# EAGLE design Op Amp VU Meter 3 Led (EAGLE 9.4.2)

## Sheet 1 of 2
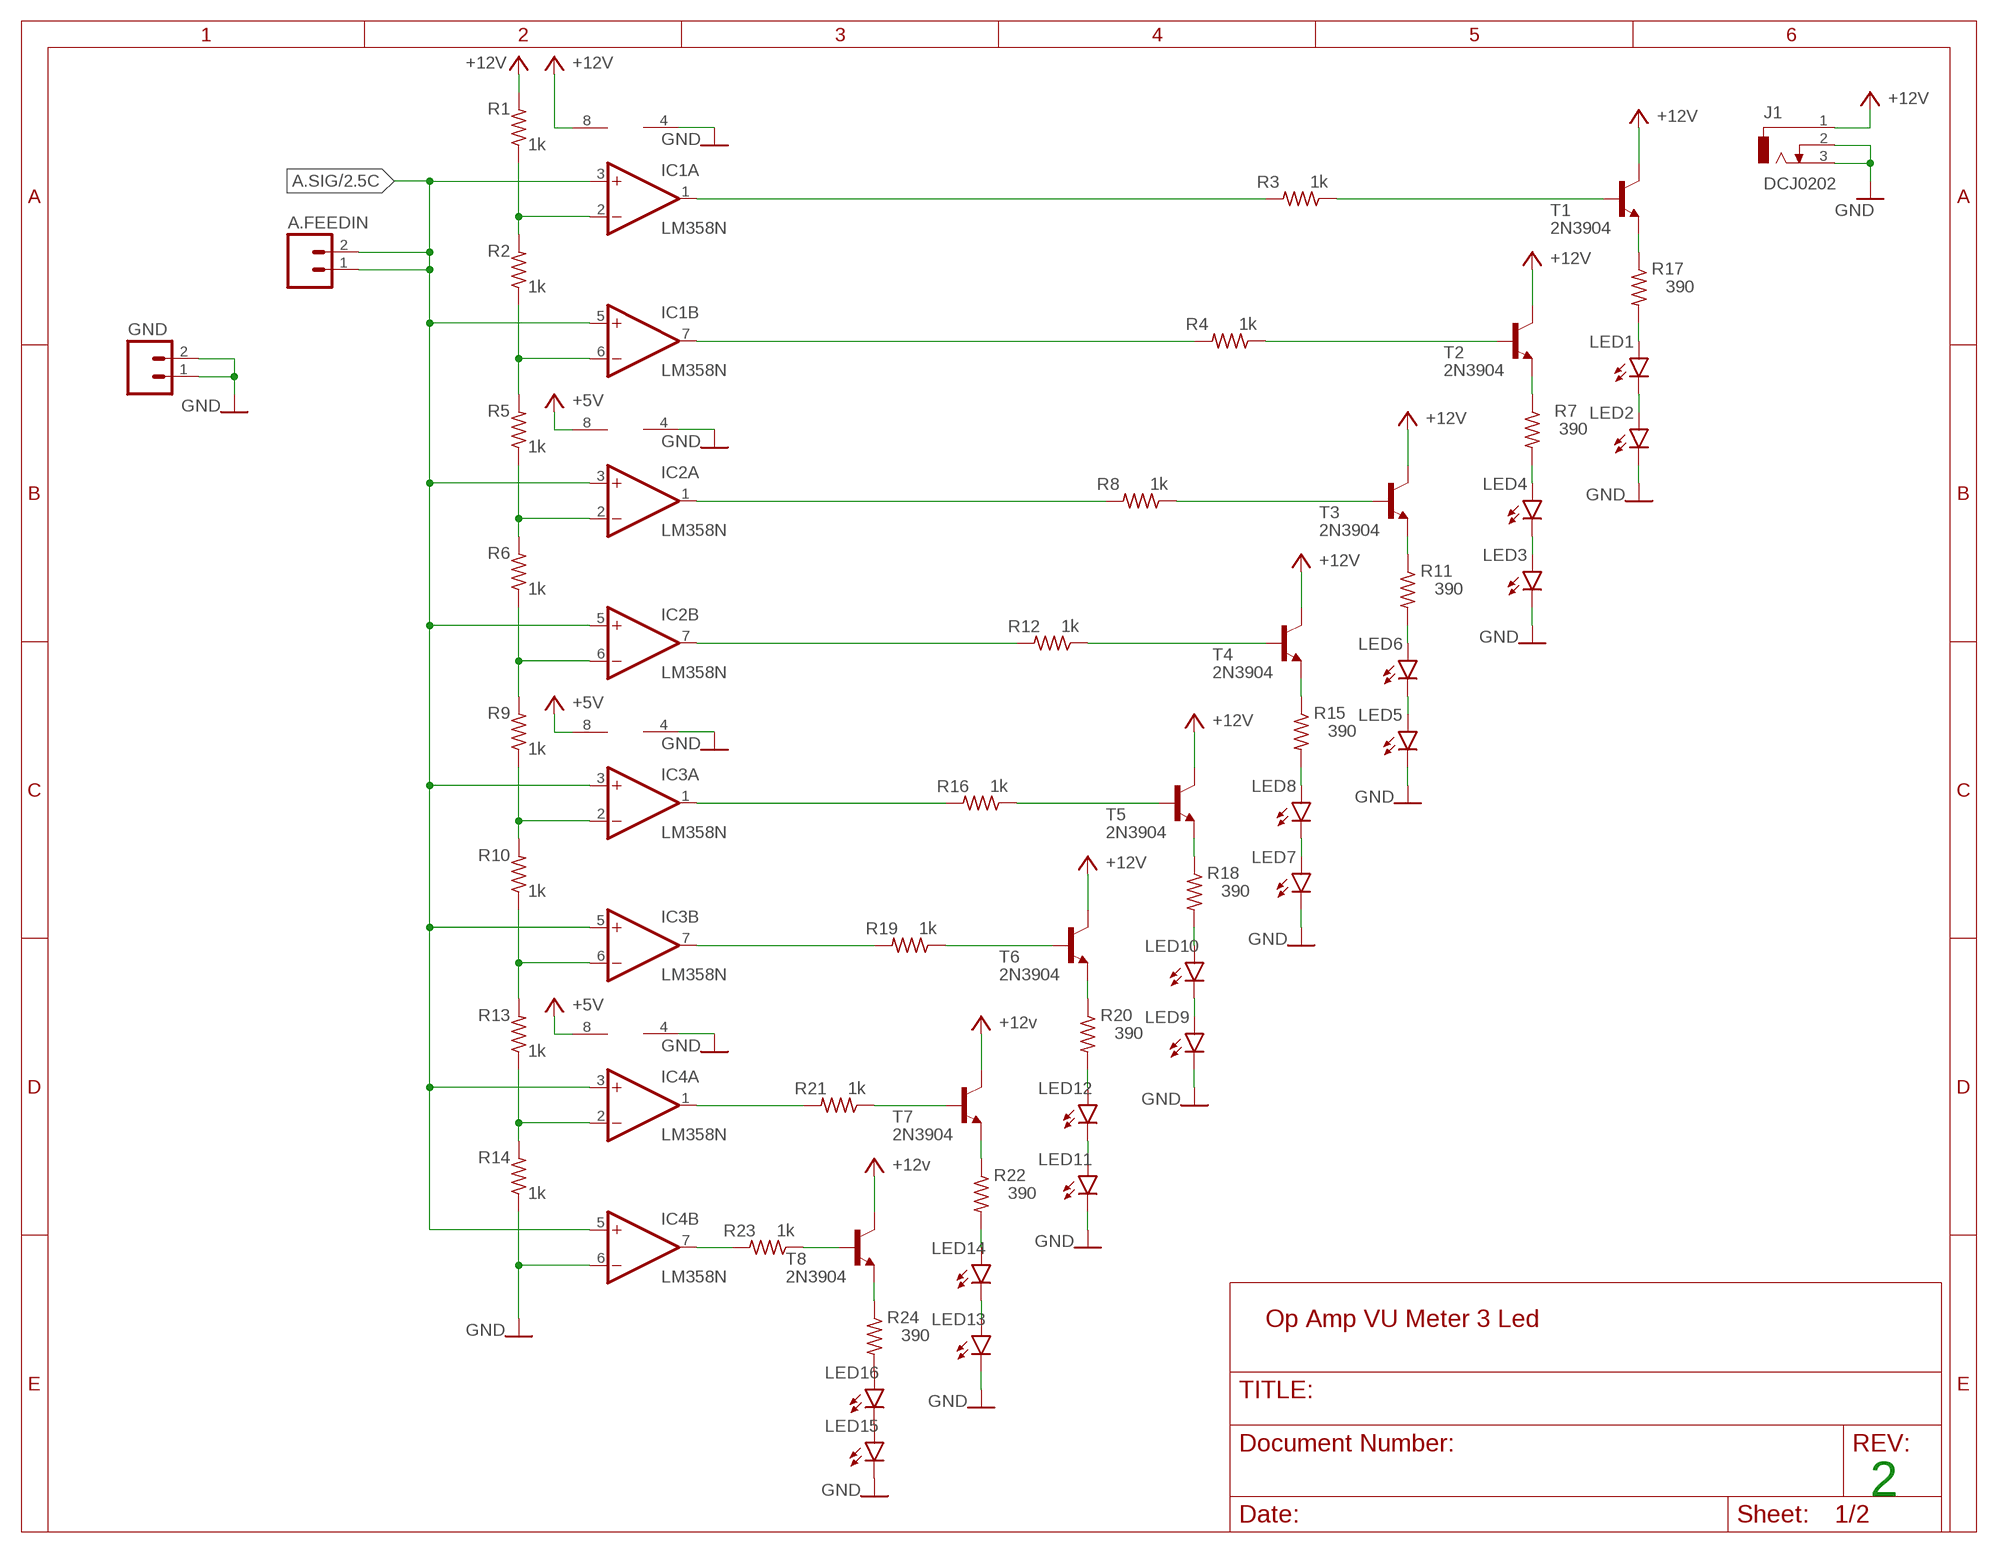
[diagram p0: schematic, sheet 1]

### Parts
A.FEEDIN  MA02  [02PA]
GND  MA02  [02PA]
IC1  LM358N  [DIL08]
IC2  LM358N  [DIL08]
IC3  LM358N  [DIL08]
IC4  LM358N  [DIL08]
J1  DCJ0202  [DCJ0202]
LED1  LED5MM  [LED5MM]
LED2  LED5MM  [LED5MM]
LED3  LED5MM  [LED5MM]
LED4  LED5MM  [LED5MM]
LED5  LED5MM  [LED5MM]
LED6  LED5MM  [LED5MM]
LED7  LED5MM  [LED5MM]
LED8  LED5MM  [LED5MM]
LED9  LED5MM  [LED5MM]
LED10  LED5MM  [LED5MM]
LED11  LED5MM  [LED5MM]
LED12  LED5MM  [LED5MM]
LED13  LED5MM  [LED5MM]
LED14  LED5MM  [LED5MM]
LED15  LED5MM  [LED5MM]
LED16  LED5MM  [LED5MM]
R1  1k  R-US_0207/12  [0207/12]
R2  1k  R-US_0207/12  [0207/12]
R3  1k  R-US_0207/12  [0207/12]
R4  1k  R-US_0207/12  [0207/12]
R5  1k  R-US_0207/12  [0207/12]
R6  1k  R-US_0207/12  [0207/12]
R7  390  R-US_0207/12  [0207/12]
R8  1k  R-US_0207/12  [0207/12]
R9  1k  R-US_0207/12  [0207/12]
R10  1k  R-US_0207/12  [0207/12]
R11  390  R-US_0207/12  [0207/12]
R12  1k  R-US_0207/12  [0207/12]
R13  1k  R-US_0207/12  [0207/12]
R14  1k  R-US_0207/12  [0207/12]
R15  390  R-US_0207/12  [0207/12]
R16  1k  R-US_0207/12  [0207/12]
R17  390  R-US_0207/12  [0207/12]
R18  390  R-US_0207/12  [0207/12]
R19  1k  R-US_0207/12  [0207/12]
R20  390  R-US_0207/12  [0207/12]
R21  1k  R-US_0207/12  [0207/12]
R22  390  R-US_0207/12  [0207/12]
R23  1k  R-US_0207/12  [0207/12]
R24  390  R-US_0207/12  [0207/12]
T1  2N3904  [TO92]
T2  2N3904  [TO92]
T3  2N3904  [TO92]
T4  2N3904  [TO92]
T5  2N3904  [TO92]
T6  2N3904  [TO92]
T7  2N3904  [TO92]
T8  2N3904  [TO92]

### Nets
+5V: IC1.8(P:V+) IC2.8(P:V+) IC3.8(P:V+) IC4.8(P:V+) J1.1 R1.2 T1.1(C) T2.1(C) T3.1(C) T4.1(C) T5.1(C) T6.1(C) T7.1(C) T8.1(C) ; supply symbol labelled +12V, +12v ; also sheet 2
A.SIG: A.FEEDIN.1 A.FEEDIN.2 IC1.3(A:+IN) IC1.5(B:+IN) IC2.3(A:+IN) IC2.5(B:+IN) IC3.3(A:+IN) IC3.5(B:+IN) IC4.3(A:+IN) IC4.5(B:+IN) ; also sheet 2
GND: GND.1 GND.2 IC1.4(P:V-) IC2.4(P:V-) IC3.4(P:V-) IC4.4(P:V-) IC4.6(B:-IN) J1.2 J1.3 LED2.K(C) LED3.K(C) LED5.K(C) LED7.K(C) LED9.K(C) LED11.K(C) LED13.K(C) LED15.K(C) R14.1 ; also sheet 2
N$1: IC1.2(A:-IN) R1.1 R2.2
N$2: IC1.6(B:-IN) R2.1 R5.2
N$3: IC1.1(A:OUT) R3.2
N$4: R3.1 T1.2(B)
N$5: IC1.7(B:OUT) R4.2
N$6: LED1.K(C) LED2.A
N$7: IC2.2(A:-IN) R5.1 R6.2
N$8: IC2.6(B:-IN) R6.1 R9.2
N$9: IC2.1(A:OUT) R8.2
N$10: LED1.A R17.2
N$11: IC2.7(B:OUT) R12.2
N$12: R8.1 T3.2(B)
N$13: IC3.6(B:-IN) R10.1 R13.2
N$14: IC3.2(A:-IN) R9.1 R10.2
N$16: IC3.1(A:OUT) R16.2
N$17: R4.1 T2.2(B)
N$18: IC3.7(B:OUT) R19.2
N$19: R7.1 T2.3(E)
N$20: IC4.2(A:-IN) R13.1 R14.2
N$22: IC4.1(A:OUT) R21.2
N$23: LED3.A LED4.K(C)
N$24: IC4.7(B:OUT) R23.2
N$25: LED4.A R7.2
N$26: R17.1 T1.3(E)
N$27: R11.1 T3.3(E)
N$28: LED5.A LED6.K(C)
N$29: LED6.A R11.2
N$30: R12.1 T4.2(B)
N$31: R15.1 T4.3(E)
N$32: LED7.A LED8.K(C)
N$33: LED8.A R15.2
N$34: R16.1 T5.2(B)
N$35: R18.1 T5.3(E)
N$36: LED9.A LED10.K(C)
N$37: LED10.A R18.2
N$38: R19.1 T6.2(B)
N$39: R20.1 T6.3(E)
N$40: LED11.A LED12.K(C)
N$41: LED12.A R20.2
N$42: R21.1 T7.2(B)
N$43: R22.1 T7.3(E)
N$44: LED13.A LED14.K(C)
N$45: LED14.A R22.2
N$46: R23.1 T8.2(B)
N$47: R24.1 T8.3(E)
N$48: LED15.A LED16.K(C)
N$49: LED16.A R24.2

### Notes on the sheet
- 2

## Sheet 2 of 2
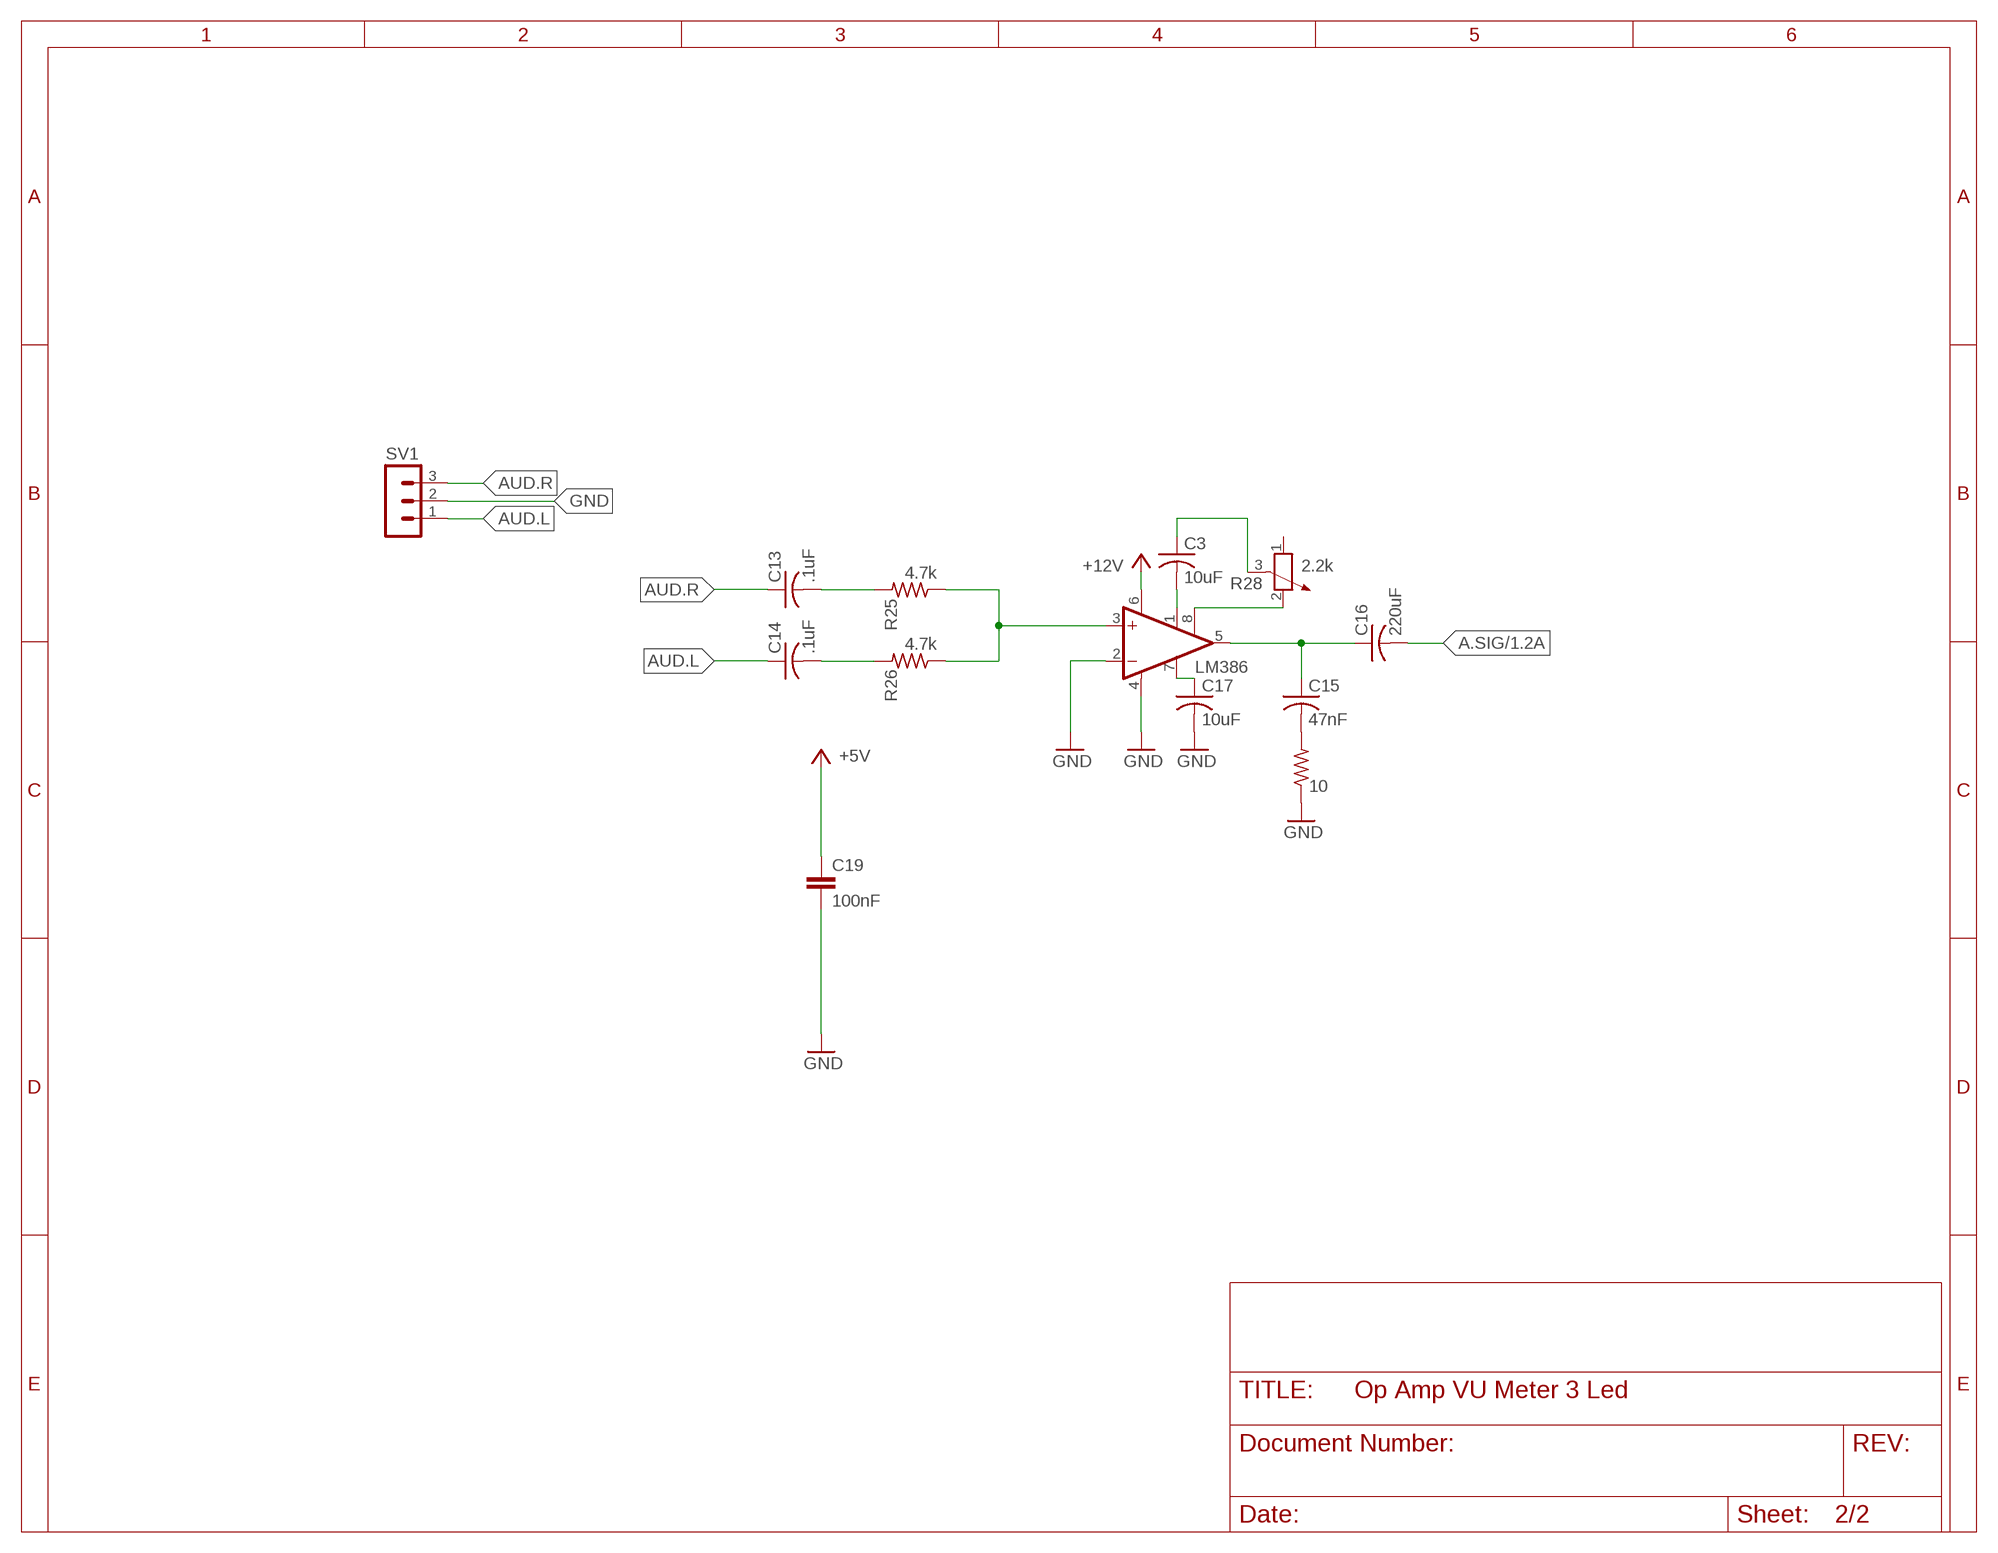
[diagram p1: schematic, sheet 2]

### Parts
C3  10uF  C-US050-024X044  [C050-024X044]
C13  .1uF  C-US050-024X044  [C050-024X044]
C14  .1uF  C-US050-024X044  [C050-024X044]
C15  47nF  C-US050-024X044  [C050-024X044]
C16  220uF  C-US050-024X044  [C050-024X044]
C17  10uF  C-US050-024X044  [C050-024X044]
C19  100nF  C-EU025-025X050  [C025-025X050]
LM386  LM386N-1  [DIL08]
R25  4.7k  R-US_0207/12  [0207/12]
R26  4.7k  R-US_0207/12  [0207/12]
R27  10  R-US_0207/12  [0207/12]
R28  2.2k  POTENTIOMETER_PT-10S  [PT-10S]
SV1  MA03-1  [MA03-1]

### Nets
+5V: C19.1 LM386.6(VS) ; supply symbol labelled +12V ; also sheet 1
A.SIG: C16.2 ; also sheet 1
AUD.L: C14.1 SV1.1
AUD.R: C13.1 SV1.3
GND: C17.2 C19.2 LM386.2(-IN) LM386.4(GND) R27.1 SV1.2 ; also sheet 1
N$15: C13.2 R25.2
N$50: C14.2 R26.2
N$51: LM386.3(+IN) R25.1 R26.1
N$52: C15.1 C16.1 LM386.5(OUT)
N$53: C17.1 LM386.7(BYPASS)
N$54: C15.2 R27.2
N$55: C3.2 LM386.1(GAIN)
N$56: LM386.8(GAIN) R28.2
N$57: C3.1 R28.3
Unconnected: R28.1

## Library data of the parts
A.FEEDIN GND = con-amp-quick:MA02: AMP QUICK CONNECTOR; OC_FARNELL: unknown; OC_NEWARK: unknown
C3 C13-C17 = rcl:C-US: CAPACITOR, American symbol; SPICEPREFIX: C
C19 = rcl:C-EU: CAPACITOR, European symbol
IC1-IC4 = linear:LM358: OP AMP also LM158; LM258; LM2904 Source: http://cache.national.com/ds/LM/LM158.pdf
J1 = con-jack:DCJ0202: DC POWER JACK Source: DCJ0202.pdf; OC_FARNELL: unknown; OC_NEWARK: unknown
LED1-LED16 = led:LED: LED OSRAM: - CHIPLED LG R971, LG N971, LY N971, LG Q971, LY Q971, LO R971, LY R971 LH N974, LH R974 LS Q976, LO Q976, LY Q976 LO Q996 - Hyper CHIPLED LW Q18S LB Q993, LB Q99A, LB R99A - SideLED LS A670, LO A670, LY A670, LG A670, LP A670 LB A673, LV A673, LT A673, LW A673 LH A674 LY A675 LS A676, LA A676, LO A676, LY A676, LW A676 LS A679, LY A679, LG A679 - Hyper Micro SIDELED® LS Y876, LA Y876, LO Y876, LY Y876 LT Y87S - SmartLED LW L88C, LW L88S LB L89C, LB L89S, LG L890 LS L89K, LO L89K, LY L89K LS L896, LA L896, LO L896, LY L896 - TOPLED LS T670, LO T670, LY T670, LG T670, LP T670 LSG T670, LSP T670, LSY T670, LOP T670, LYG T670 LG T671, LOG T671, LSG T671 LB T673, LV T673, LT T673, LW T673 LH T674 LS T676, LA T676, LO T676, LY T676, LB T676, LH T676, LSB T676, LW T676 LB T67C, LV T67C, LT T67C, LS T67K, LO T67K, LY T67K, LW E67C LS E67B, LA E67B, LO E67B, LY E67B, LB E67C, LV E67C, LT E67C LW T67C LS T679, LY T679, LG T679 LS T770, LO T770, LY T770, LG T770, LP T770 LB T773, LV T773, LT T773, LW T773 LH T774 LS E675, LA E675, LY E675, LS T675 LS T776, LA T776, LO T776, LY T776, LB T776 LHGB T686 LT T68C, LB T68C - Hyper Mini TOPLED® LB M676 - Mini TOPLED Santana® LG M470 LS M47K, LO M47K, LY M47K Source: http://www.osram.convergy.de LUXEON: - LUMILED® LXK2-PW12-R00, LXK2-PW12-S00, LXK2-PW14-U00, LXK2-PW14-V00 LXK2-PM12-R00, LXK2-PM12-S00, LXK2-PM14-U00 LXK2-PE12-Q00, LXK2-PE12-R00, LXK2-PE12-S00, LXK2-PE14-T00, LXK2-PE14-U00 LXK2-PB12-K00, LXK2-PB12-L00, LXK2-PB12-M00, LXK2-PB14-N00, LXK2-PB14-P00, LXK2-PB14-Q00 LXK2-PR12-L00, LXK2-PR12-M00, LXK2-PR14-Q00, LXK2-PR14-R00 LXK2-PD12-Q00, LXK2-PD12-R00, LXK2-PD12-S00 LXK2-PH12-R00, LXK2-PH12-S00 LXK2-PL12-P00, LXK2-PL12-Q00, LXK2-PL12-R00 Source: www.luxeon.com KINGBRIGHT: KA-3528ASYC Source: www.kingbright.com
LM386 = linear:LM386?-*: Low Voltage Audio Power Amplifier Source: http://cache.national.com/ds/LM/LM386.pdf
R1-R27 = rcl:R-US_: RESISTOR, American symbol; SPICEPREFIX: R
R28 = rcl:POTENTIOMETER_: Potentiometer; SPICEMODEL: POT; SPICEPREFIX: X
SV1 = con-lstb:MA03-1: PIN HEADER; OC_FARNELL: unknown; OC_NEWARK: unknown
T1-T8 = transistor:2N3904: NPN TRANSISTOR

## Board
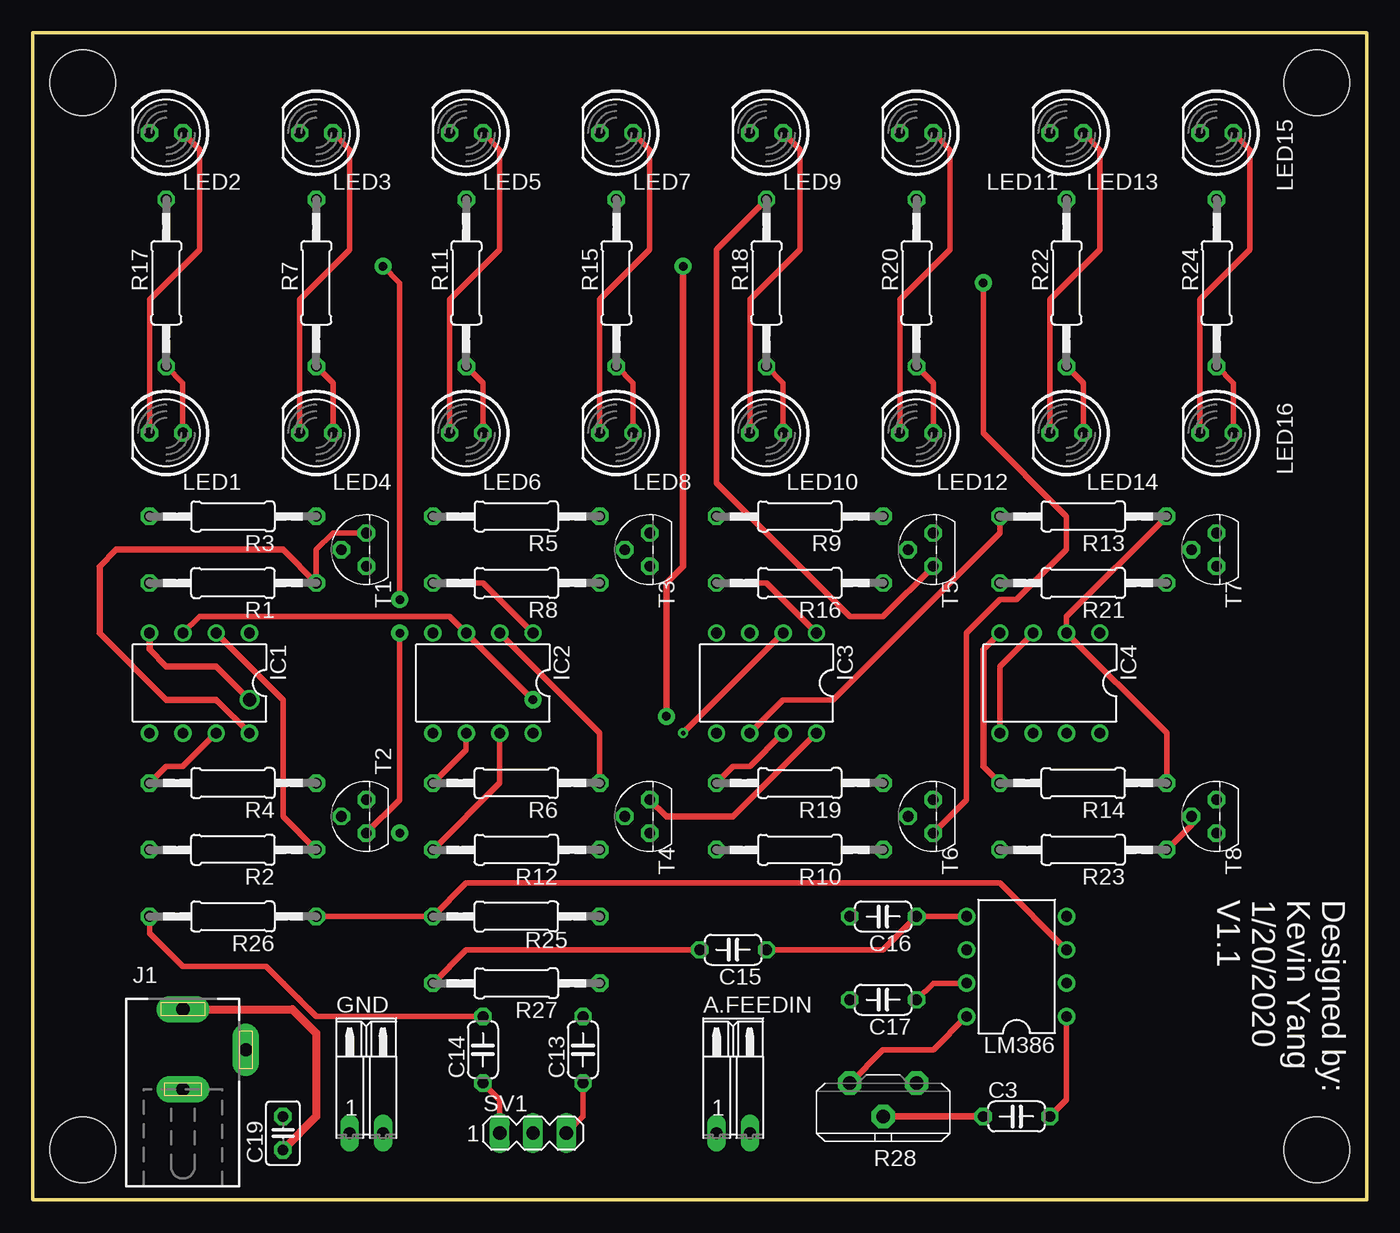
[diagram p2: board, top side]
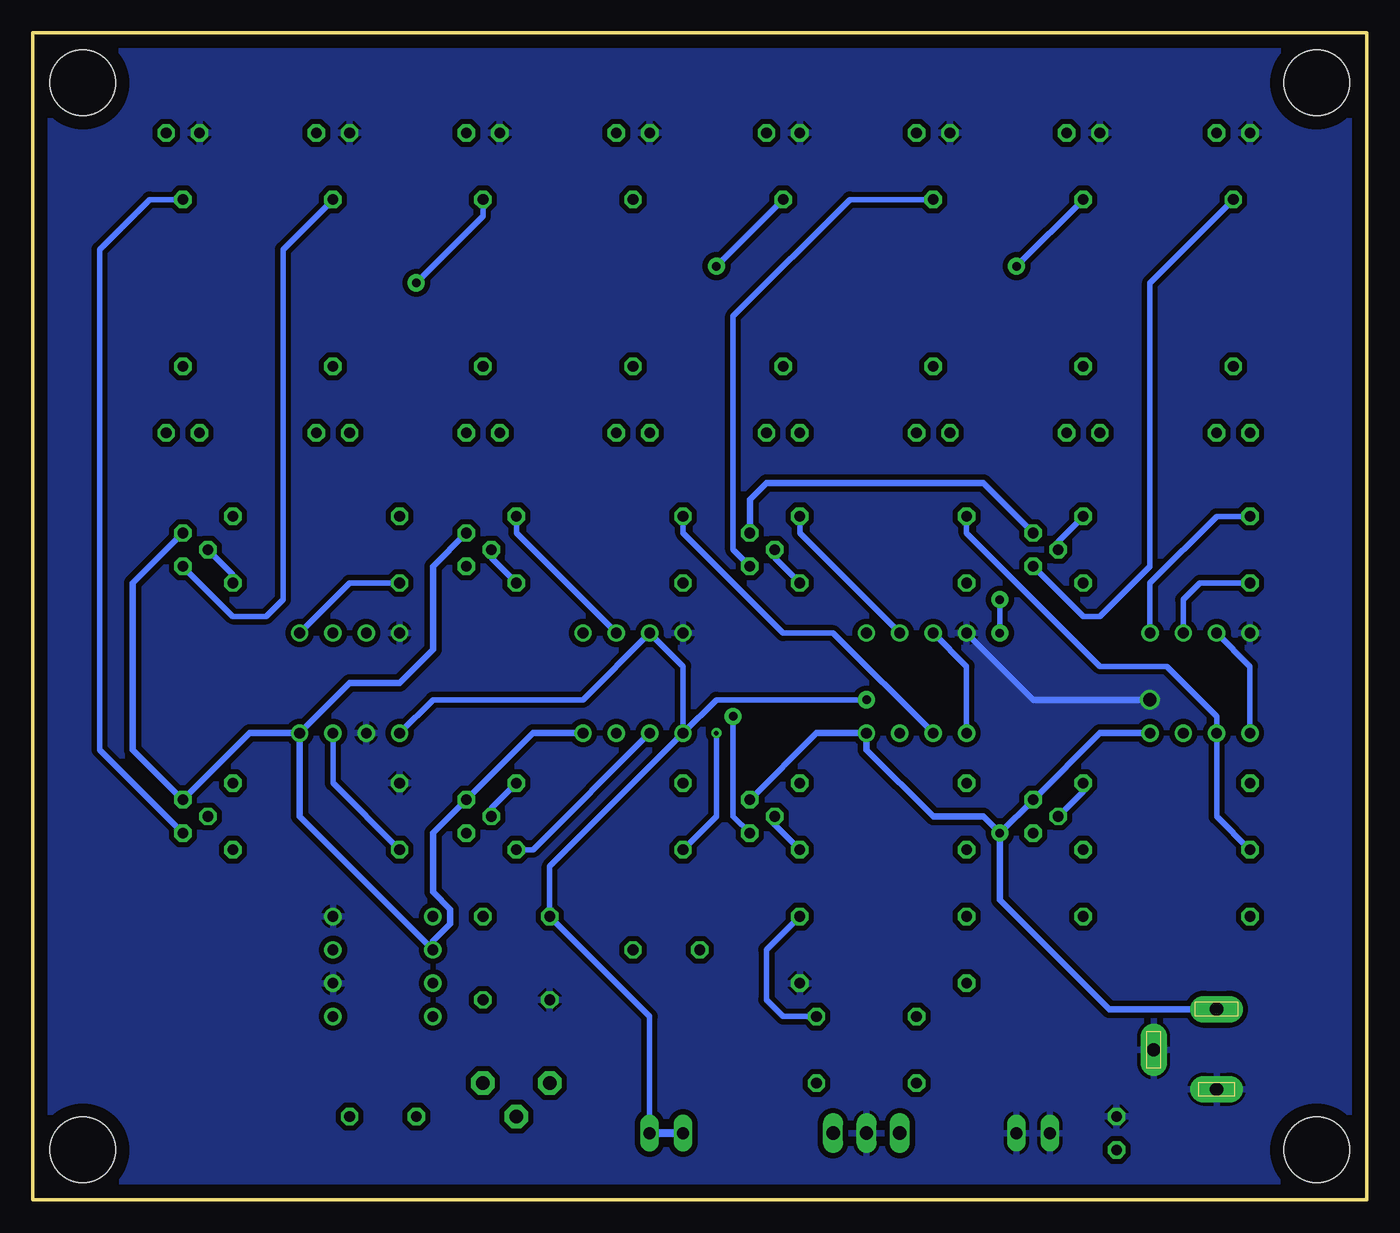
[diagram p3: board, bottom side, seen from below]

Size 101.6 x 88.9 mm. Coordinates in mm from the lower left corner, seen from the top.
Outline: 0,0 101.6,0 101.6,88.9 0,88.9 0,0
Copper layers (1*16): Top 0.035mm / dielectric 1.5mm / Bottom 0.035mm
Design rules "JLCPCB rules *": minimum track width 6mil, minimum drill 0.35mm, track to track 6mil, track to pad 6mil, pad to pad 6mil, via to via 6mil, smd to smd 6mil, copper to edge 40mil, drill to drill 6mil, minimum pad ring 10mil, minimum via ring 8mil, stop-mask expansion 4mil, vias tented up to drill 0mil, thermal gap 10mil
Holes 5 mm at 3.81,85.09 97.79,85.09 97.79,3.81 3.81,3.81

### Footprints (pad centres in the part's own frame; a part is rotated, then mirrored left to right if it is on the bottom)
02PA = drill 0.914 long: 1 -1.27,0; 2 1.27,0
C050-024X044 = drill 0.813 octagon: 1 -2.54,0; 2 2.54,0
C025-025X050 = drill 0.813 octagon: 1 -1.27,0; 2 1.27,0
DIL08 = drill 0.813 pad 1.27: 1 -3.81,-3.81; 2 -1.27,-3.81; 3 1.27,-3.81; 4 3.81,-3.81; 5 3.81,3.81; 6 1.27,3.81; 7 -1.27,3.81; 8 -3.81,3.81
DCJ0202 = drill 1 pad 2 long: 1 0,3.1; 2 4.8,0; 3 0,-3
LED5MM = drill 0.813 octagon: A -1.27,0; K 1.27,0
0207/12 = drill 0.813 octagon: 1 -6.35,0; 2 6.35,0
PT-10S = drill 1.016 pad 1.778 octagon: 1 -2.54,-1.27; 2 2.54,-1.27; 3 0,1.27
MA03-1 = drill 1.016 long: 1 -2.54,0; 2 0,0; 3 2.54,0
TO92 = drill 0.813 octagon: 1 1.27,0; 2 0,1.905; 3 -1.27,0

### Placement (x,y rotation side)
A.FEEDIN  53.34,5.08 0 top
C3  74.93,6.35 0 top
C13  41.91,11.43 90 top
C14  34.29,11.43 90 top
C15  53.34,19.05 180 top
C16  64.77,21.59 180 top
C17  64.77,15.24 180 top
C19  19.05,5.08 90 top
GND  25.4,5.08 0 top
IC1  12.7,39.37 180 top
IC2  34.29,39.37 180 top
IC3  55.88,39.37 180 top
IC4  77.47,39.37 180 top
J1  11.43,11.43 0 top
LED1  10.16,58.42 180 top
LED2  10.16,81.28 180 top
LED3  21.59,81.28 180 top
LED4  21.59,58.42 180 top
LED5  33.02,81.28 180 top
LED6  33.02,58.42 180 top
LED7  44.45,81.28 180 top
LED8  44.45,58.42 180 top
LED9  55.88,81.28 180 top
LED10  55.88,58.42 180 top
LED11  67.31,81.28 180 top
LED12  67.31,58.42 180 top
LED13  78.74,81.28 180 top
LED14  78.74,58.42 180 top
LED15  90.17,81.28 180 top
LED16  90.17,58.42 180 top
LM386  74.93,17.78 90 top
R1  15.24,46.99 0 top
R2  15.24,26.67 0 top
R3  15.24,52.07 180 top
R4  15.24,31.75 180 top
R5  36.83,52.07 180 top
R6  36.83,31.75 0 top
R7  21.59,69.85 270 top
R8  36.83,46.99 180 top
R9  58.42,52.07 180 top
R10  58.42,26.67 180 top
R11  33.02,69.85 270 top
R12  36.83,26.67 180 top
R13  80.01,52.07 180 top
R14  80.01,31.75 0 top
R15  44.45,69.85 270 top
R16  58.42,46.99 180 top
R17  10.16,69.85 270 top
R18  55.88,69.85 270 top
R19  58.42,31.75 180 top
R20  67.31,69.85 270 top
R21  80.01,46.99 180 top
R22  78.74,69.85 270 top
R23  80.01,26.67 180 top
R24  90.17,69.85 270 top
R25  36.83,21.59 0 top
R26  15.24,21.59 180 top
R27  36.83,16.51 180 top
R28  64.77,7.62 180 top
SV1  38.1,5.08 0 top
T1  25.4,49.53 90 top
T2  25.4,29.21 90 top
T3  46.99,49.53 90 top
T4  46.99,29.21 90 top
T5  68.58,49.53 90 top
T6  68.58,29.21 90 top
T7  90.17,49.53 90 top
T8  90.17,29.21 90 top

### Tracks (layer width: path | path; a pad name or v marks a point on that pad's centre or on a via)
+5V  (via drill 0.65 pad 1.3)
  Top 0.406: R1.2 21.59,49.53 22.86,50.8 T1.1
  Top 0.508: R1.2 19.05,49.53 6.35,49.53 5.08,48.26 5.08,43.18 10.16,38.1 13.97,38.1 IC1.8 | IC3.8 53.34,29.21 48.26,29.21 T4.1
  Top 0.61: J1.1 19.76,14.53 21.59,12.7 21.59,6.35 C19.1
  Bottom 0.508: IC4.8 81.28,29.21 LM386.6 71.12,19.72 69.8,21.04 69.8,22.14 71.12,23.46 71.12,27.94 T6.1 63.5,35.56 IC3.8 | IC4.8 85.09,35.56 T8.1 93.98,34.29 93.98,46.99 T7.1 | J1.1 19.61,14.53 27.94,22.86 v27.94,27.94 | v27.94,27.94 T2.1 20.32,35.56 IC1.8 | T4.1 41.91,35.56 IC2.8 38.1,34.29 33.02,29.21 29.21,29.21 v27.94,27.94 | IC4.8 77.47,39.37 73.66,39.37 71.12,41.91 71.12,48.26 T5.1 | T3.1 46.99,53.34 45.72,54.61 29.21,54.61 T1.1
A.SIG  (via drill 0.65 pad 1.3)
  Top 0.406: IC1.3 12.7,44.45 31.75,44.45 IC2.3 v38.1,38.1 | IC4.5 73.66,40.64 IC4.3
  Bottom 0.406: A.FEEDIN.2 54.61,13.97 C16.2 62.23,25.4 IC3.5 | IC1.5 8.89,40.64 IC1.3 | IC2.5 30.48,40.64 IC2.3 | IC3.5 49.53,38.1 v38.1,38.1 | IC3.5 52.07,40.64 IC3.3 59.69,38.1 71.12,38.1 IC4.5
  Bottom 0.61: A.FEEDIN.1 A.FEEDIN.2
AUD.L
  Top 0.406: SV1.1 35.56,7.62 C14.1
AUD.R
  Top 0.406: SV1.3 41.91,6.35 C13.1
GND  (via drill 1)
  Top 0.508: IC4.4 72.39,41.91 72.39,33.02 R14.1 | IC1.4 8.89,41.91 10.16,40.64 13.97,40.64 v16.51,38.1
  Bottom 0.508: IC2.4 25.4,38.1 v16.51,38.1
  pour Bottom (isolate 0.406): 0,88.9 101.6,88.9 101.6,0 0,0
N$1
  Top 0.406: R2.2 19.05,29.21 19.05,38.1 IC1.2
  Bottom 0.406: R1.1 12.7,46.99 13.97,45.72 IC1.2
N$2
  Bottom 0.406: R2.1 11.43,29.21 IC1.6 11.43,36.83 15.24,40.64 20.32,40.64 30.48,50.8 R5.2
N$3
  Bottom 0.406: R3.2 11.43,52.07 16.51,46.99 IC1.1
N$4
  Bottom 0.406: R3.1 23.49,50.17 T1.2
N$5
  Top 0.406: R4.2 10.16,33.02 11.43,33.02 IC1.7
N$6
  Top 0.406: LED1.K 8.89,68.58 12.7,72.39 12.7,80.01 LED2.A
N$7
  Top 0.406: IC2.2 43.18,35.56 R6.2
  Bottom 0.406: IC2.2 43.18,50.8 R5.1
N$8
  Top 0.406: R6.1 33.02,34.29 IC2.6
  Bottom 0.406: IC2.6 40.64,43.18 44.45,43.18 52.07,50.8 R9.2
N$9
  Top 0.406: IC2.1 34.29,46.99 R8.2
N$10
  Top 0.406: LED1.A 11.43,62.23 R17.2
N$11
  Top 0.406: R12.2 35.56,31.75 IC2.7
N$12
  Bottom 0.406: R8.1 45.09,48.89 T3.2
N$13
  Top 0.406: IC3.6 57.15,38.1 60.96,38.1 73.66,50.8 R13.2
  Bottom 0.406: IC3.6 63.5,26.67 R10.1
N$14  (via drill 0.35)
  Top 0.406: v49.53,35.56 IC3.2
  Bottom 0.406: IC3.2 64.77,50.8 R9.1 | R10.2 49.53,29.21 v49.53,35.56
N$15
  Bottom 0.406: R25.2 45.72,19.05 45.72,15.24 44.45,13.97 C13.2
N$16
  Top 0.406: R16.2 55.88,46.99 IC3.1
N$17
  Bottom 0.406: T2.2 21.59,31.11 R4.1
N$18
  Top 0.406: R19.2 53.34,33.02 54.61,33.02 IC3.7
N$19  (via drill 0.65 pad 1.3)
  Top 0.406: T2.3 27.94,30.48 v27.94,43.18 | v27.94,45.72 27.94,69.85 v26.67,71.12
  Bottom 0.406: v27.94,43.18 v27.94,45.72 | v26.67,71.12 R7.1
N$20
  Top 0.406: R14.2 86.36,35.56 IC4.2 78.74,44.45 R13.1
N$22
  Bottom 0.406: R21.2 77.47,46.99 IC4.1
N$23
  Top 0.406: LED4.K 20.32,68.58 24.13,72.39 24.13,80.01 LED3.A
N$24
  Bottom 0.406: R23.2 78.74,31.75 IC4.7
N$25
  Top 0.406: LED4.A 22.86,62.23 R7.2
N$26
  Bottom 0.406: T1.3 21.59,44.45 20.32,44.45 16.51,48.26 16.51,69.85 R17.1
N$27
  Bottom 0.406: T3.3 48.26,49.53 48.26,67.31 39.37,76.2 R11.1
N$28
  Top 0.406: LED6.K 31.75,68.58 35.56,72.39 35.56,80.01 LED5.A
N$29
  Top 0.406: LED6.A 34.29,62.23 R11.2
N$30
  Bottom 0.508: R12.1 45.09,28.57 T4.2
N$31  (via drill 0.65 pad 1.3)
  Top 0.508: v48.26,36.83 48.26,46.99 49.53,48.26 v49.53,71.12
  Bottom 0.406: T4.3 48.26,29.21 v48.26,36.83
  Bottom 0.508: v49.53,71.12 R15.1
N$32
  Top 0.406: LED8.K 43.18,68.58 46.99,72.39 46.99,80.01 LED7.A
N$33
  Top 0.406: LED8.A 45.72,62.23 R15.2
N$34
  Bottom 0.406: T5.2 66.67,48.89 R16.1
N$35
  Top 0.406: T5.3 64.77,44.45 62.23,44.45 52.07,54.61 52.07,72.39 R18.1
N$36
  Top 0.406: LED10.K 54.61,68.58 58.42,72.39 58.42,80.01 LED9.A
N$37
  Top 0.406: LED10.A 57.15,62.23 R18.2
N$38
  Bottom 0.406: R19.1 66.67,29.85 T6.2
N$39  (via drill 0.65 pad 1.3)
  Top 0.406: T6.3 71.12,30.48 71.12,43.18 73.66,45.72 74.93,45.72 78.74,49.53 78.74,52.07 72.39,58.42 v72.39,69.85
  Bottom 0.406: v72.39,69.85 67.31,74.93 R20.1
N$40
  Top 0.406: LED12.K 66.04,68.58 69.85,72.39 69.85,80.01 LED11.A
N$41
  Top 0.406: LED12.A 68.58,62.23 R20.2
N$42
  Bottom 0.406: T7.2 86.36,47.62 R21.1
N$43
  Bottom 0.406: T7.3 86.36,44.45 83.82,44.45 82.55,45.72 82.55,72.39 R22.1
N$44
  Top 0.406: LED14.K 77.47,68.58 81.28,72.39 81.28,80.01 LED13.A
N$45
  Top 0.406: LED14.A 80.01,62.23 R22.2
N$46
  Top 0.406: T8.2 88.27,28.57 R23.1
N$47
  Bottom 0.406: T8.3 96.52,34.29 96.52,72.39 92.71,76.2 R24.1
N$48
  Top 0.406: LED16.K 88.9,68.58 92.71,72.39 92.71,80.01 LED15.A
N$49
  Top 0.406: LED16.A 91.44,62.23 R24.2
N$50
  Top 0.406: C14.2 21.59,13.97 17.78,17.78 11.43,17.78 8.89,20.32 R26.2
N$51
  Top 0.406: R26.1 R25.1 33.02,24.13 73.66,24.13 LM386.3
N$52
  Top 0.406: C15.1 64.77,19.05 C16.1 LM386.5
N$53
  Top 0.406: C17.1 68.58,16.51 LM386.7
N$54
  Top 0.406: R27.2 33.02,19.05 C15.2
N$55
  Top 0.406: C3.2 78.74,7.62 LM386.1
N$56
  Top 0.406: R28.2 64.77,11.43 68.58,11.43 LM386.8
N$57
  Top 0.508: R28.3 C3.1

### Text on the board
tNames: Designed by: / Kevin Yang / 1/20/2020 / V1.1